# EAGLE schematic Pure LFO (EAGLE 8.7.0)
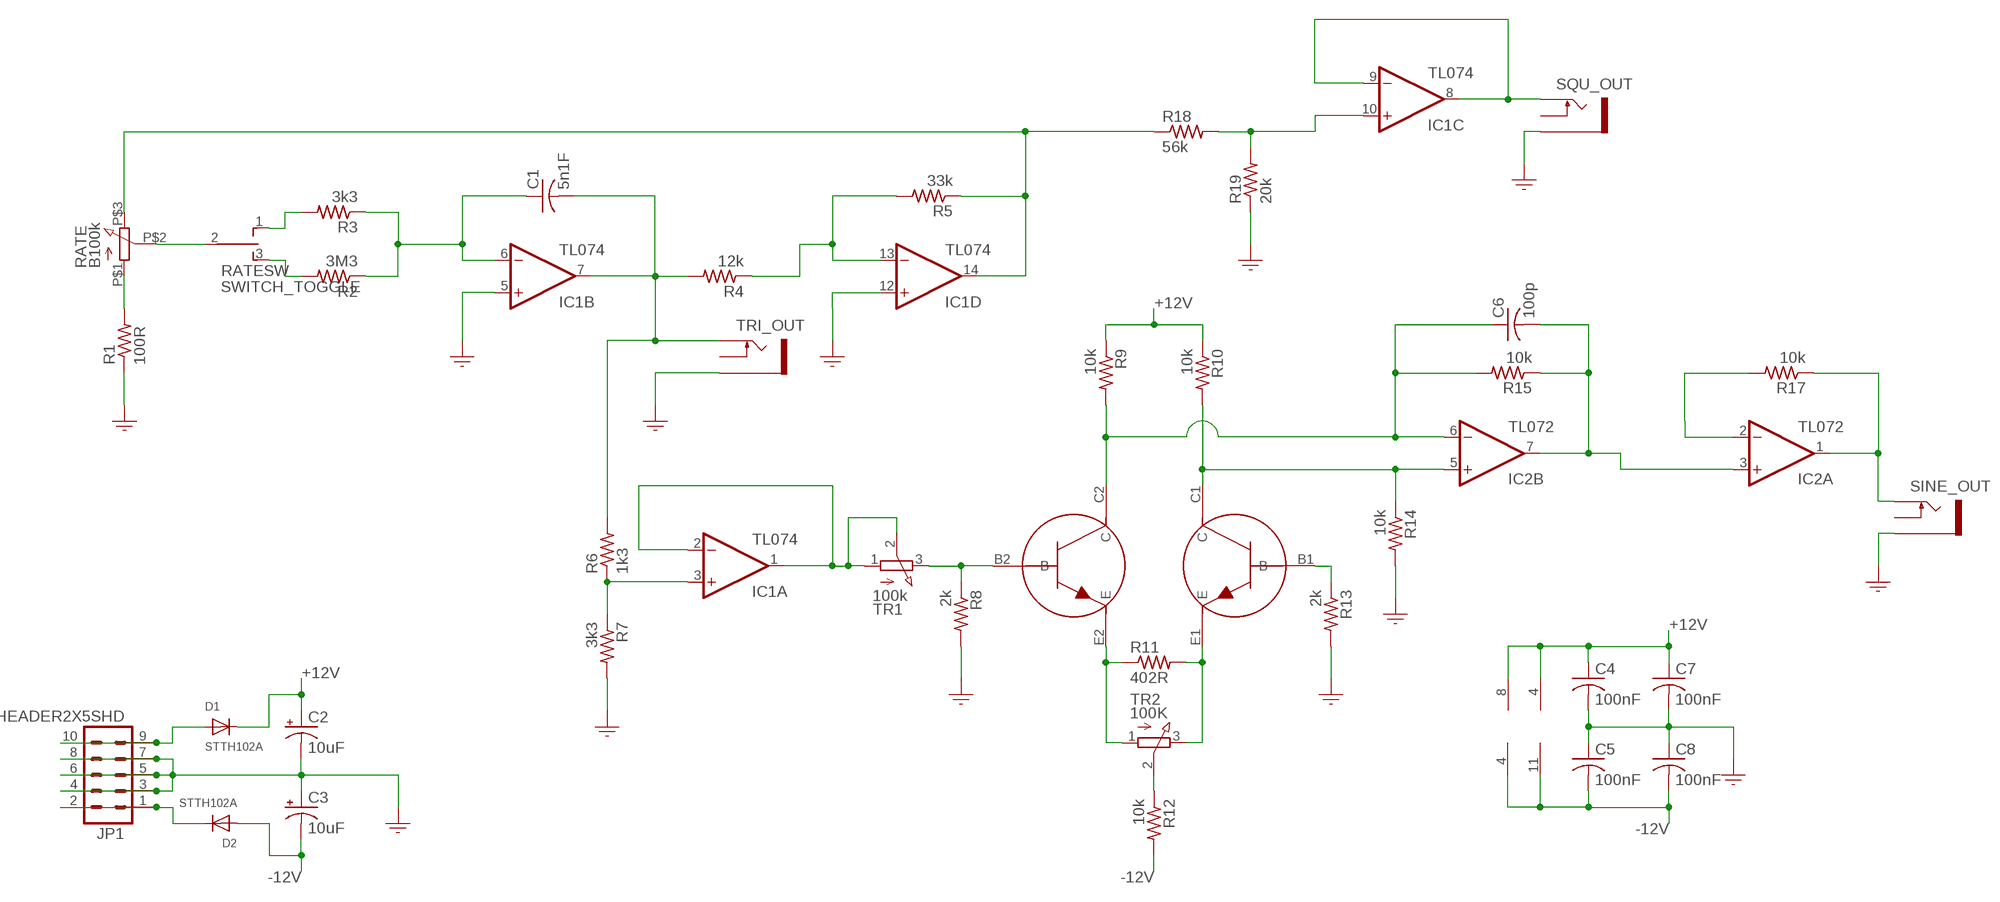
[diagram p0: schematic, sheet 1]

## Parts
C1  5n1F  CAPACITOR-USC0805  [C0805]
C2  10uF  CAPACITOR_POL-US153CLV-0505  [153CLV-0505]
C3  10uF  CAPACITOR_POL-US153CLV-0505  [153CLV-0505]
C4  100nF  CAPACITOR-USC0805  [C0805]
C5  100nF  CAPACITOR-USC0805  [C0805]
C6  100p  CAPACITOR-USC0805  [C0805]
C7  100nF  CAPACITOR-USC0805  [C0805]
C8  100nF  CAPACITOR-USC0805  [C0805]
D1  STTH102A  DIODESMA  [SMADIODE]
D2  STTH102A  DIODESMA  [SMADIODE]
IC1  TL074  OPAMP_QUADD  [SO14]
IC2  TL072  OPAMP_DUALD  [SO08]
JP1  HEADER2X5SHD  [2X5-SHROUDED]
R1  100R  RESISTOR_USR0805  [R0805]
R2  3M3  RESISTOR_USR0805  [R0805]
R3  3k3  RESISTOR_USR0805  [R0805]
R4  12k  RESISTOR_USR0805  [R0805]
R5  33k  RESISTOR_USR0805  [R0805]
R6  1k3  RESISTOR_USR0805  [R0805]
R7  3k3  RESISTOR_USR0805  [R0805]
R8  2k  RESISTOR_USR0805  [R0805]
R9  10k  RESISTOR_USR0805  [R0805]
R10  10k  RESISTOR_USR0805  [R0805]
R11  402R  RESISTOR_USR0805  [R0805]
R12  10k  RESISTOR_USR0805  [R0805]
R13  2k  RESISTOR_USR0805  [R0805]
R14  10k  RESISTOR_USR0805  [R0805]
R15  10k  RESISTOR_USR0805  [R0805]
R17  10k  RESISTOR_USR0805  [R0805]
R18  56k  RESISTOR_USR0805  [R0805]
R19  20k  RESISTOR_USR0805  [R0805]
RATE  B100k  RESISTOR_VARIABLE9MM_POT  [POTENTIOMETER_9MM]
RATESW  SWITCH_TOGGLE  [TOGGLE_SW]
SINE_OUT  SOCKET_MONO_3.5MMPJ301M-12  [PJ301M-12]
SQU_OUT  SOCKET_MONO_3.5MMPJ301M-12  [PJ301M-12]
T3  DMMT3904W-7-F  TRANSISTOR_PAIR_NPN  [TRANS_PAIR]
TR1  100k  RESISTOR_VARIABLETRIMMER_TH  [TRIMMER_TH]
TR2  100K  RESISTOR_VARIABLETRIMMER_TH  [TRIMMER_TH]
TRI_OUT  SOCKET_MONO_3.5MMPJ301M-12  [PJ301M-12]

## Nets
+12V: C2.+ C4.1 C7.1 D1.C IC1.4(P:V+) IC2.8(P:V+) R9.1 R10.1
-12V: C3.- C5.2 C8.2 D2.A IC1.11(P:V-) IC2.4(P:V-) R12.2
GND: C2.- C3.+ C4.2 C5.1 C7.2 C8.1 IC1.5(B:+IN) IC1.12(D:+IN) JP1.3 JP1.4 JP1.5 JP1.6 JP1.7 JP1.8 R1.1 R7.2 R8.2 R13.2 R14.2 R19.1 SINE_OUT.GND(SLEEVE) SQU_OUT.GND(SLEEVE) TRI_OUT.GND(SLEEVE)
N$1: R1.2 RATE.P$1
N$2: RATE.P$2 RATESW.2(P)
N$3: R3.2 RATESW.1(O)
N$4: R2.2 RATESW.3(S)
N$5: IC1.10(C:+IN) R18.2 R19.2
N$6: C1.1 IC1.6(B:-IN) R2.1 R3.1
N$7: C1.2 IC1.7(B:OUT) R4.2 R6.2 TRI_OUT.TIP
N$8: IC1.8(C:OUT) IC1.9(C:-IN) SQU_OUT.TIP
N$9: IC1.13(D:-IN) R4.1 R5.2
N$11: D1.A JP1.9 JP1.10
N$13: IC1.14(D:OUT) R5.1 R18.1 RATE.P$3
N$21: R11.1 T3.E2(E) TR2.1
N$25: R8.1 T3.B2(B) TR1.3
N$26: R11.2 T3.E1(E) TR2.3
N$27: R12.1 TR2.2
N$28: R13.1 T3.B1(B)
N$32: C6.1 IC2.6(B:-IN) R9.2 R15.2 T3.C2(C)
N$33: IC1.1(A:OUT) IC1.2(A:-IN) TR1.1 TR1.2
N$34: IC2.5(B:+IN) R10.2 R14.1 T3.C1(C)
N$35: IC1.3(A:+IN) R6.1 R7.1
N$38: IC2.2(A:-IN) R17.2
N$50: D2.C JP1.1 JP1.2
SINE: IC2.1(A:OUT) R17.1 SINE_OUT.TIP
SINE_PRE: C6.2 IC2.3(A:+IN) IC2.7(B:OUT) R15.1
Unconnected: SINE_OUT.NORM(SWITCH) SQU_OUT.NORM(SWITCH) TRI_OUT.NORM(SWITCH)

## Library data of the parts
C1 C4-C8 = GMSN:CAPACITOR-US: Capacitor; SORT: 3
C2 C3 = GMSN:CAPACITOR_POL-US: Electro Capacitor; SORT: 6
D1 D2 = GMSN:DIODE: Diode SMADIODE - SMA Surface Mount Package 20V 1A Schottky Diode Digikey: 641-1014-6-ND DO-1N4148 - Through Hole Small Current Diode SOD-123 20V 1 A (.5mV Vf) Schottky Diode - Digikey: MBRX120TPMSCT-ND SOD-323 10V 570mA (.38mV Vf, 3ns) Schottky Diode - Digikey: ZLLS410CT-ND SOD-523 30V 30mA Schottky Diode (RB751S-40TE61) - Digikey: RB751S-40TE61CT-ND SOT23-R/W - SOT23 Package (R = Solder Paste/Reflow Ovens, W = Hand-Soldering) BAT54Film 40V 300mA - Digikey: 497-7162-1-ND; SORT: 1
IC1 = GMSN:OPAMP_QUAD: OP AMP; SORT: 4
IC2 = GMSN:OPAMP_DUAL: OP AMP; SORT: 4
JP1 = GMSN:HEADER2X5: Header 5x2 Standard 10-pin dual row 0.1" header. Commonly used with AVR-ISP. Use with Spark Fun Electronics SKU: PRT-00778; SORT: 7
R1-R15 R17-R19 = GMSN:RESISTOR_US: Resistor; SORT: 2
RATE = GMSN:RESISTOR_VARIABLE: Potentiometer; SORT: 8
RATESW = GMSN:SWITCH_TOGGLE: On-Off-On Switch; SORT: 9
SINE_OUT SQU_OUT TRI_OUT = GMSN:SOCKET_MONO_3.5MM: 3.5 mm jack socket; SORT: 8
T3 = GMSN:TRANSISTOR_PAIR_NPN: NPN Transistor Matched Pair; SORT: 4
TR1 TR2 = GMSN:RESISTOR_VARIABLE: Potentiometer; SORT: 7